# Altium schematic sheet [03] - Amplifier and ADC.SchDoc: =ProjectName
size A4; CheckedBy: Ven; Author: Ven; CompanyName: HUST; Revision: V.1.0
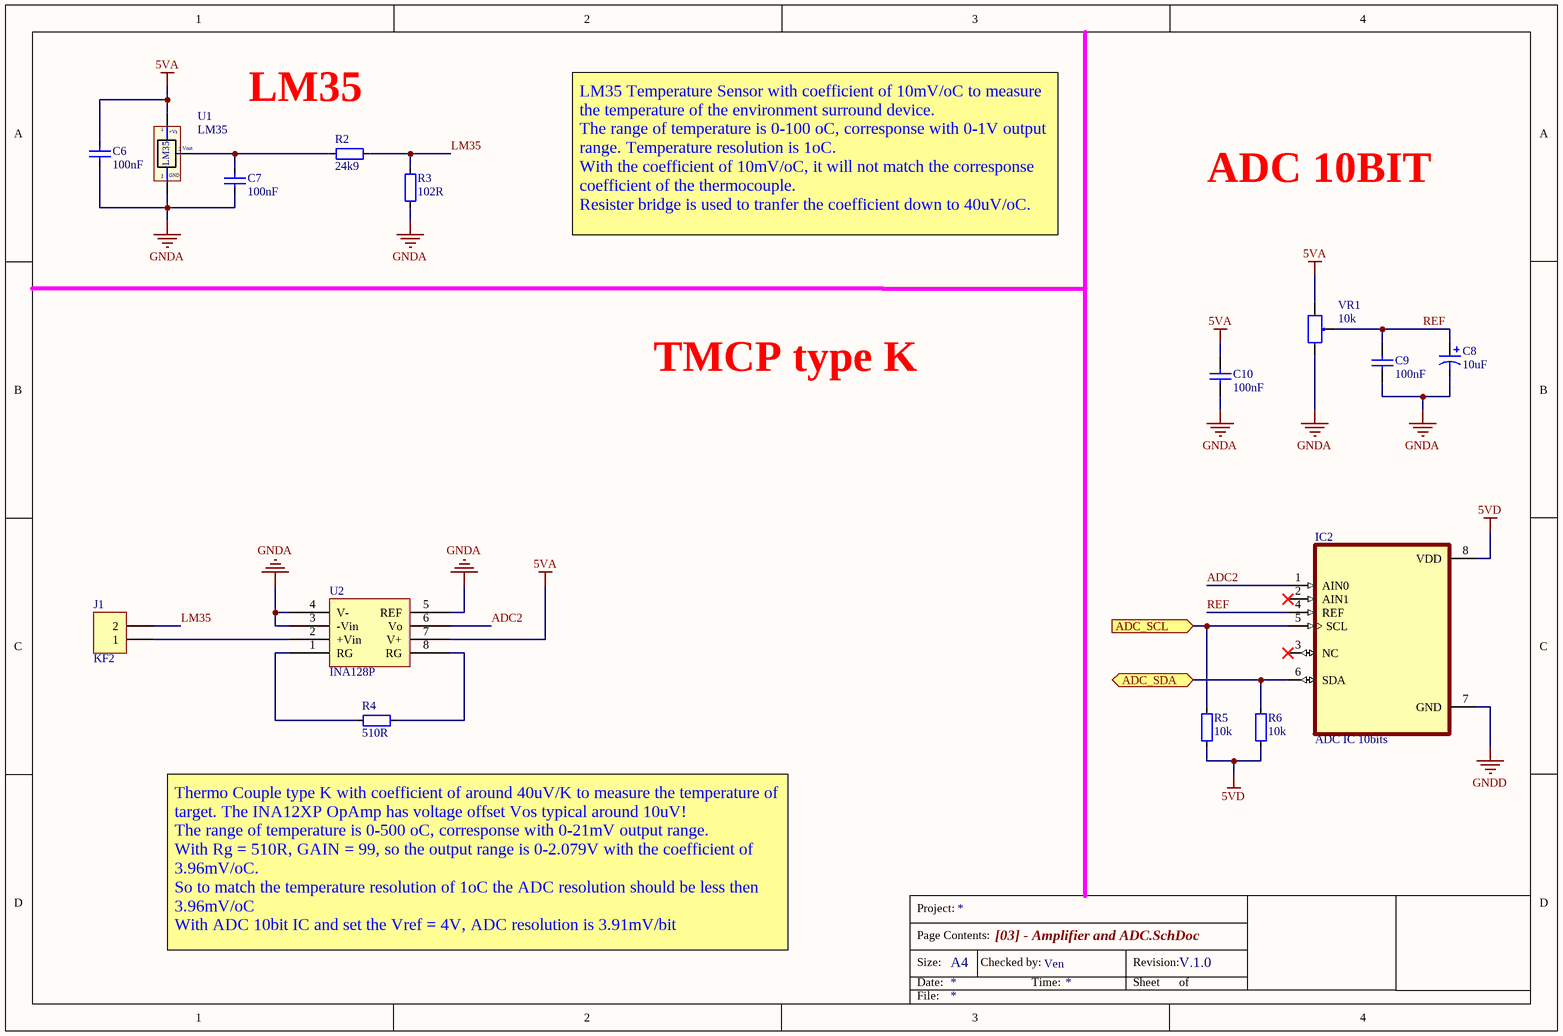
[diagram p0: [03] - Amplifier and ADC.SchDoc]

## Parts
C6  100nF  [CAP_0805]
C7  100nF  [CAP_0805]
C8  10uF  [C8mm]
C9  100nF  [CAP_0805]
C10  100nF  [CAP_0805]
IC2  ADC IC 10bits  [SOP - 8 µMAX]
J1  KF2  [KF2-5.08T]
R2  24k9  [RES-SMD-0805]
R3  102R  [RES-SMD-0805]
R4  510R  [RES-SMD-0805]
R5  10k  [RES-SMD-0805]
R6  10k  [RES-SMD-0805]
U1  LM35  [QTO-92]
U2  INA128P  [SOP-8]
VR1  10k  [VR]

## Ports
ADC_SCL (in), ADC_SDA (bidir)

## Nets
5VA: C6.2 C10.2 U1.1(+Vs) U2.7(V+) VR1.1
5VD: IC2.8(VDD) R5.1 R6.1
GNDA: C6.1 C7.1 C8.2 C9.1 C10.1 R3.1 U1.3(-) U2.3(-Vin) U2.4(V-) U2.5(REF) VR1.3
GNDD: IC2.7(GND)
ADC2: IC2.1(AIN0) U2.6(Vo)
ADC_SCL: IC2.5(SCL) R5.2 ; port ADC_SCL
ADC_SDA: IC2.6(SDA) R6.2 ; port ADC_SDA
LM35: J1.2 R2.1 R3.2
REF: C8.1 C9.2 IC2.4(REF) VR1.2
NetC7_2: C7.2 R2.2 U1.2(Vout)
NetJ1_1: J1.1 U2.2(+Vin)
NetR4_1: R4.1 U2.1(RG)
NetR4_2: R4.2 U2.8(RG)

Not connected (* = marked no-connect by the designer): IC2 2(AIN1)* 3(NC)*

## Notes on the sheet
- LM35
- ADC 10BIT
- LM35 Temperature Sensor with coefficient of 10mV/oC to measure the temperature of the environment surround device.
  The range of temperature is 0-100 oC, corresponse with 0-1V output range. Temperature resolution is 1oC.
  With the coefficient of 10mV/oC, it will not match the corresponse coefficient of the thermocouple.
  Resister bridge is used to tranfer the coefficient down to 40uV/oC.
- TMCP type K
- Thermo Couple type K with coefficient of around 40uV/K to measure the temperature of target. The INA12XP OpAmp has voltage offset Vos typical around 10uV!
  The range of temperature is 0-500 oC, corresponse with 0-21mV output range.
  With Rg = 510R, GAIN = 99, so the output range is 0-2.079V with the coefficient of 3.96mV/oC.
  So to match the temperature resolution of 1oC the ADC resolution should be less then 3.96mV/oC
  With ADC 10bit IC and set the Vref = 4V, ADC resolution is 3.91mV/bit
- Project:
- Page Contents:
- Size:
- Date:
- A4
- Checked by:
- Time:
- Revision:
- Sheet
- of
- File:
- (in symbol LM35) GND

## Library data of the parts
C6 C7 C9 C10 = CapSMD: Capacitor; Value: 33p; Published: 8-Jun-2000; LatestRevisionDate: 17-Jul-2002; LatestRevisionNote: Re-released for DXP Platform.; PackageReference: RAD-0.3; Publisher: Altium Limited
C8 = Cap Pol: Polarized Capacitor (Axial); Published: 8-Jun-2000; LatestRevisionDate: 17-Jul-2002; LatestRevisionNote: Re-released for DXP Platform.; PackageReference: POLAR0.8; Publisher: Altium Limited
IC2 = MAX11646
J1 = KF2: Couple Thermo type K; Manufacturer: Würth Elektronik eiSos GmbH; partNo: 691103110002; ComponentLink1 Description: Manufacturer; ComponentLink2 Description: Datasheet; NoPins: 2; Created Date: 29 October 2013; ComponentLink1URL: http://www.we-online.com; ComponentLink2URL: http://katalog.we-online.de/em/datasheet/6911031100xx.pdf; Created by: Karrer Zheng
R2-R6 = Resistor - SMD: Resistor; Manufacturer: Generic Components; Class: Passive; Published: 08/06/2000; Publisher: Altium Hobart Technology Centre
U1 = LM35: Teminal; Value: LM35
U2 = INA129PA: Instrumental Operate Amplifier
VR1 = VR: Var Resistor; Value: VR 10K